# Altium project investigator_oring.PrjPcb
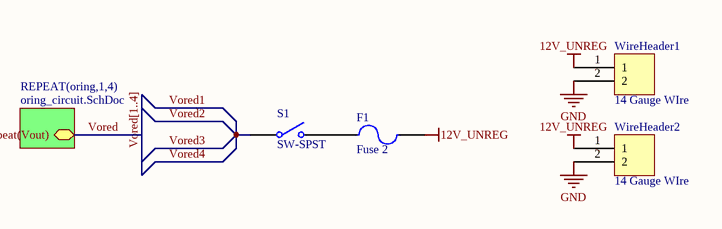
[diagram p0: investigator_oring.SchDoc]
2 sheets, 28 parts. Net scope: hierarchical (ports join the sheet entries above them; power ports are global).
Board file: investigator_oring.PcbDoc
Sheets:
  investigator_oring.SchDoc
    oring1 = oring_circuit.SchDoc
    oring2 = oring_circuit.SchDoc
    oring3 = oring_circuit.SchDoc
    oring4 = oring_circuit.SchDoc

## Sheet investigator_oring.SchDoc
size Letter

### Parts
F1  Fuse 2  [FUSE]
S1  SW-SPST  [switch]
WireHeader1  14 Gauge WIre  [WireHeader]
WireHeader2  14 Gauge WIre  [WireHeader]

### Sub-sheets
REPEAT(oring,1,4) = oring_circuit.SchDoc: Repeat(Vout)

### Nets
12V_UNREG: F1.2 WireHeader1.1 WireHeader2.1
GND: WireHeader1.2 WireHeader2.2
Vored: sheet REPEAT(oring,1,4)/Repeat(Vout)
Vored1: S1.1(COMMON)  [also labelled Vored2, Vored3, Vored4]
NetF1_1: F1.1 S1.2(NO)

### Buses and harness runs
bus Vored[1..4]

### Library data of the parts
F1 = Fuse 2: Fuse; Published: 8-Jun-2000; LatestRevisionDate: 17-Jul-2002; LatestRevisionNote: Re-released for DXP Platform.; PackageReference: PIN-W2/E2.8; Publisher: Altium Limited; PackageDescription: Thru-Hole; 2 Leads
S1 = SW-SPST: Single-Pole, Single-Throw Switch; Published: 24-Mar-1999; LatestRevisionDate: 17-Jul-2002; LatestRevisionNote: Re-released for DXP Platform.; PackageReference: SPST-2; Publisher: Altium Limited; PackageDescription: Switch; 2 Leads
WireHeader1 WireHeader2 = WireHeader

## Sheet oring_circuit.SchDoc
size Letter
Used 4 times, as channels oring1, oring2, oring3, oring4. Parts and nets are listed once, with the designators drawn on the sheet.
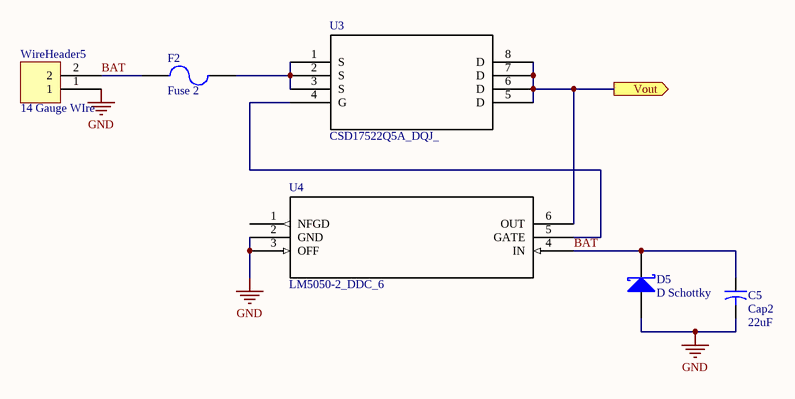
[diagram p1: oring_circuit.SchDoc]

### Parts
C5  Cap2  value 22uF  [CAPR5-4X5]
D5  D Schottky  [DIODE]
F2  Fuse 2  [FUSE]
U3  CSD17522Q5A_DQJ_  [DQJ8]
U4  LM5050-2_DDC_6  [MK06A]
WireHeader5  14 Gauge WIre  [WireHeader]

### Ports
Vout (out)

### Nets
GND: C5.2 D5.1(A) U4.2(GND) U4.3(OFF) WireHeader5.1
BAT: C5.1 D5.2(K) F2.1 U4.4(IN) WireHeader5.2
Vout: U3.5(D) U3.6(D) U3.7(D) U3.8(D) U4.6(OUT) ; port Vout
NetF2_2: F2.2 U3.1(S) U3.2(S) U3.3(S)
NetU3_4: U3.4(G) U4.5(GATE)

Not connected (* = marked no-connect by the designer): U4 1(NFGD)

### Channels
oring1: designators end in _oring1; ports Vout=Vored1
oring2: designators end in _oring2; ports Vout=Vored1
oring3: designators end in _oring3; ports Vout=Vored1
oring4: designators end in _oring4; ports Vout=Vored1

### Library data of the parts
C5 = Cap2: Capacitor; Published: 23-Sep-2002; PackageReference: CAPR5-4X5; Publisher: Altium Limited; PackageDescription: Capacitor; 2 Leads
D5 = D Schottky: Schottky Diode; Published: 8-Jun-2000; LatestRevisionDate: 17-Jul-2002; LatestRevisionNote: Re-released for DXP Platform.; PackageReference: SMB; Publisher: Altium Limited; PackageDescription: DO-214-AA/SMB; 2 C-Bend Leads; Body 5.3 x 3.6 mm, inc. leads (LxW); Code_JEDEC: DO-214-AA
F2 = Fuse 2: Fuse; Published: 8-Jun-2000; LatestRevisionDate: 17-Jul-2002; LatestRevisionNote: Re-released for DXP Platform.; PackageReference: PIN-W2/E2.8; Publisher: Altium Limited; PackageDescription: Thru-Hole; 2 Leads
U3 = CSD17522Q5A_DQJ_: Imported; Manufacturer: Texas Instruments; INDUSTRY_STD_PKG_TYPE: SON; FAMILY_NAME: N-Channel MOSFET Transistors; PIN_COUNT: 8; PACKAGE_DESIGNATOR: DQJ; Datasheet URL: http://www.ti.com/lit/gpn/CSD17522Q5A; GENERIC_PART_NUMBER: CSD17522Q5A; RefDes: RefDes; Type: DEV; Value: Value
U4 = LM5050-2_DDC_6: Imported; Manufacturer: Texas Instruments; DatasheetURL: http://www.ti.com/lit/ds/symlink/lm5050-2.pdf; basePN: LM5050-2; NSC_PackageReference: MK06A; Manufacturer_Part_Number: lm5050-2_ddc_6; Vendor: Texas Instruments; RefDes: RefDes; Type: DEV; Value: Value
WireHeader5 = WireHeader

## Nets that join several sheets
GND: investigator_oring (WireHeader1.2 WireHeader2.2), oring1 (5 pins), oring2 (5 pins), oring3 (5 pins), oring4 (5 pins)
Vored1: investigator_oring (S1.1), oring1 (5 pins), oring2 (5 pins), oring3 (5 pins), oring4 (5 pins)